# Altium schematic sheet lpc11c14.SchDoc
size A4; Organization: UNSW Solar Racing Team; Address3: UNSW; Address4: Sydney NSW 2052; Address2: Electrical Engineering; Address1: Rm 109
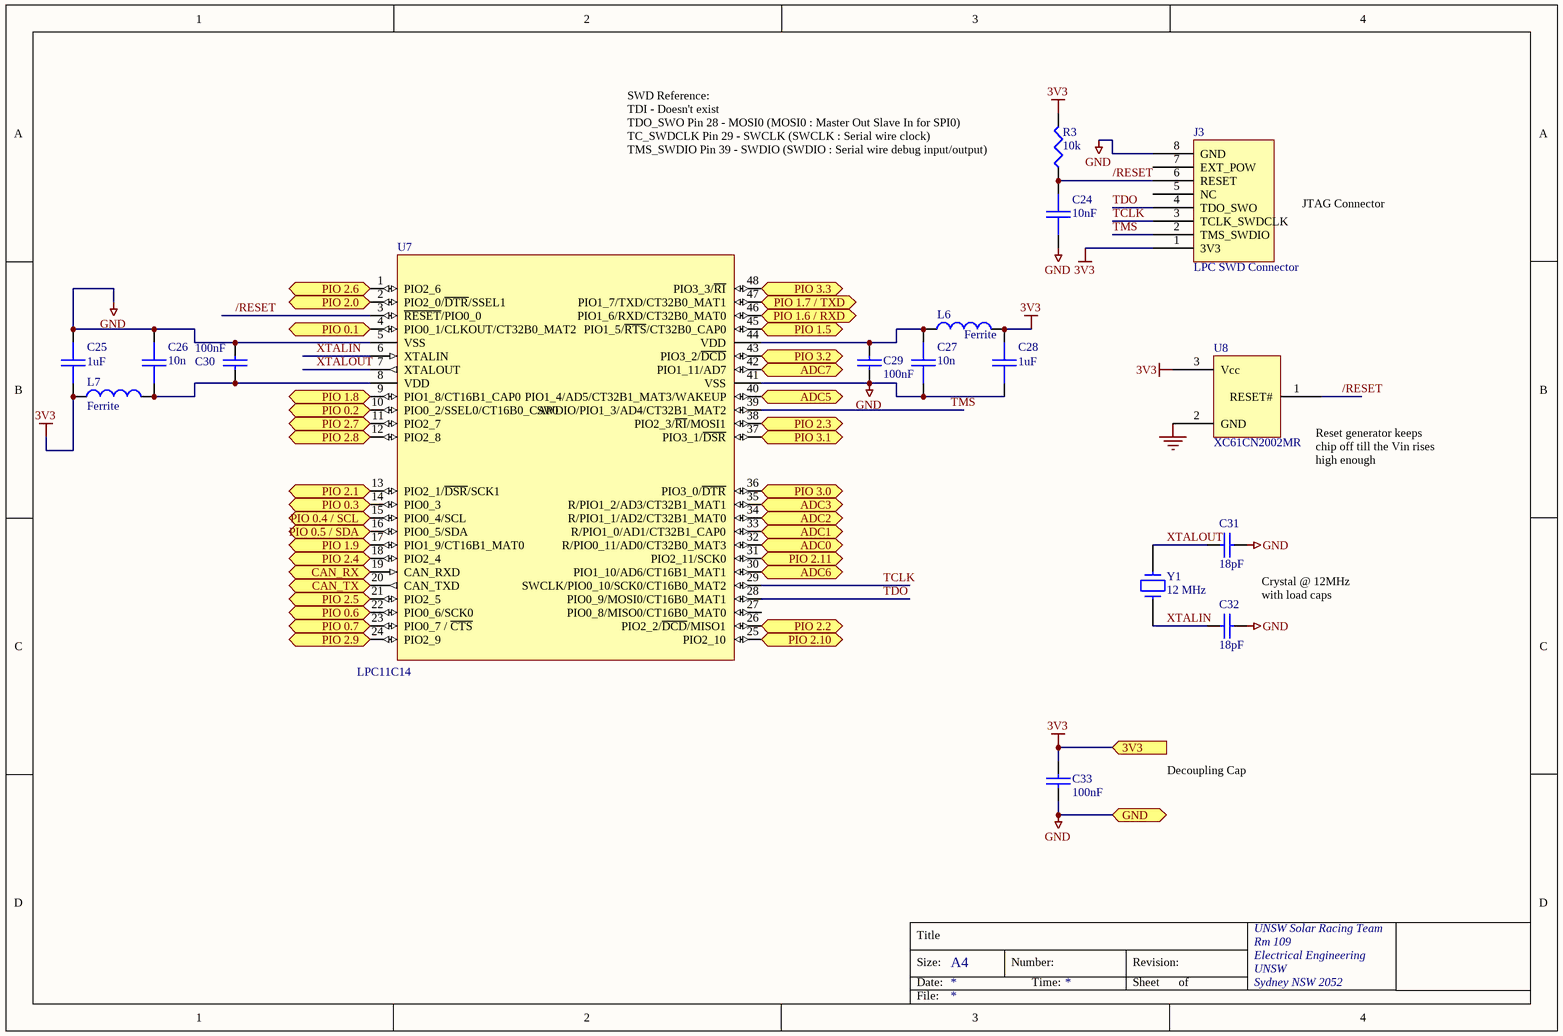
[diagram p0: lpc11c14.SchDoc]

## Parts
C24  10nF  [0603]
C25  value 1uF  [0603]  (hidden comment: 1u)
C26  10n  [0603]
C27  10n  [0603]
C28  value 1uF  [0603]  (hidden comment: 1u)
C29  100nF  [0603]
C30  100nF  [0603]
C31  18pF  [0603]
C32  18pF  [0603]
C33  100nF  [0603]
J3  LPC SWD Connector  [IDC8]
L6  Ferrite  [0603]
L7  Ferrite  [0603]
R3  10k  [0603]
U7  LPC11C14  [TSQFP50P900X900-48N]
U8  XC61CN2002MR  [SOT23(3)]
Y1  12 MHz  [HC49/4H]

## Ports
3V3, ADC0 (in), ADC1 (in), ADC2 (in), ADC3 (in), ADC5 (in), ADC6 (in), ADC7 (in), CAN_RX (in), CAN_TX (out), GND, PIO 0.1 (bidir), PIO 0.2 (bidir), PIO 0.3 (bidir), PIO 0.4 / SCL (bidir), PIO 0.5 / SDA (bidir), PIO 0.6 (bidir), PIO 0.7 (bidir), PIO 1.5 (bidir), PIO 1.6 / RXD (bidir), PIO 1.7 / TXD (bidir), PIO 1.8 (bidir), PIO 1.9 (bidir), PIO 2.0 (bidir), PIO 2.1 (bidir), PIO 2.2 (bidir), PIO 2.3 (bidir), PIO 2.4 (bidir), PIO 2.5 (bidir), PIO 2.6 (bidir), PIO 2.7 (bidir), PIO 2.8 (bidir), PIO 2.9 (bidir), PIO 2.10 (bidir), PIO 2.11 (bidir), PIO 3.0 (bidir), PIO 3.1 (bidir), PIO 3.2 (bidir), PIO 3.3 (bidir)

## Nets
3V3: C25.2 C28.1 C33.1 J3.1(3V3) L6.2 L7.1 R3.2 U8.3(Vcc) ; port 3V3
GND: C24.2 C25.1 C26.1 C27.2 C28.2 C29.2 C30.1 C31.2 C32.2 C33.2 J3.8(GND) U7.5(VSS) U7.41(VSS) U8.2(GND) ; port GND
/RESET: C24.1 J3.6(RESET) R3.1 U7.3(~{RESET}/PIO0_0) U8.1(RESET#)
ADC0: U7.32(R/PIO0_11/AD0/CT32B0_MAT3) ; port ADC0
ADC1: U7.33(R/PIO1_0/AD1/CT32B1_CAP0) ; port ADC1
ADC2: U7.34(R/PIO1_1/AD2/CT32B1_MAT0) ; port ADC2
ADC3: U7.35(R/PIO1_2/AD3/CT32B1_MAT1) ; port ADC3
ADC5: U7.40(PIO1_4/AD5/CT32B1_MAT3/WAKEUP) ; port ADC5
ADC6: U7.30(PIO1_10/AD6/CT16B1_MAT1) ; port ADC6
ADC7: U7.42(PIO1_11/AD7) ; port ADC7
CAN_RX: U7.19(CAN_RXD) ; port CAN_RX
CAN_TX: U7.20(CAN_TXD) ; port CAN_TX
PIO 0.1: U7.4(PIO0_1/CLKOUT/CT32B0_MAT2) ; port PIO 0.1
PIO 0.2: U7.10(PIO0_2/SSEL0/CT16B0_CAP0) ; port PIO 0.2
PIO 0.3: U7.14(PIO0_3) ; port PIO 0.3
PIO 0.4 / SCL: U7.15(PIO0_4/SCL) ; port PIO 0.4 / SCL
PIO 0.5 / SDA: U7.16(PIO0_5/SDA) ; port PIO 0.5 / SDA
PIO 0.6: U7.22(PIO0_6/SCK0) ; port PIO 0.6
PIO 0.7: U7.23(PIO0_7_/_~{CTS}) ; port PIO 0.7
PIO 1.5: U7.45(PIO1_5/~{RTS}/CT32B0_CAP0) ; port PIO 1.5
PIO 1.6 / RXD: U7.46(PIO1_6/RXD/CT32B0_MAT0) ; port PIO 1.6 / RXD
PIO 1.7 / TXD: U7.47(PIO1_7/TXD/CT32B0_MAT1) ; port PIO 1.7 / TXD
PIO 1.8: U7.9(PIO1_8/CT16B1_CAP0) ; port PIO 1.8
PIO 1.9: U7.17(PIO1_9/CT16B1_MAT0) ; port PIO 1.9
PIO 2.0: U7.2(PIO2_0/~{DTR}/SSEL1) ; port PIO 2.0
PIO 2.1: U7.13(PIO2_1/~{DSR}/SCK1) ; port PIO 2.1
PIO 2.2: U7.26(PIO2_2/~{DCD}/MISO1) ; port PIO 2.2
PIO 2.3: U7.38(PIO2_3/~{RI}/MOSI1) ; port PIO 2.3
PIO 2.4: U7.18(PIO2_4) ; port PIO 2.4
PIO 2.5: U7.21(PIO2_5) ; port PIO 2.5
PIO 2.6: U7.1(PIO2_6) ; port PIO 2.6
PIO 2.7: U7.11(PIO2_7) ; port PIO 2.7
PIO 2.8: U7.12(PIO2_8) ; port PIO 2.8
PIO 2.9: U7.24(PIO2_9) ; port PIO 2.9
PIO 2.10: U7.25(PIO2_10) ; port PIO 2.10
PIO 2.11: U7.31(PIO2_11/SCK0) ; port PIO 2.11
PIO 3.0: U7.36(PIO3_0/~{DTR}) ; port PIO 3.0
PIO 3.1: U7.37(PIO3_1/~{DSR}) ; port PIO 3.1
PIO 3.2: U7.43(PIO3_2/~{DCD}) ; port PIO 3.2
PIO 3.3: U7.48(PIO3_3/~{RI}) ; port PIO 3.3
TCLK: J3.3(TCLK_SWDCLK) U7.29(SWCLK/PIO0_10/SCK0/CT16B0_MAT2)
TDO: J3.4(TDO_SWO) U7.28(PIO0_9/MOSI0/CT16B0_MAT1)
TMS: J3.2(TMS_SWDIO) U7.39(SWDIO/PIO1_3/AD4/CT32B1_MAT2)
XTALIN: C32.1 U7.6(XTALIN) Y1.1
XTALOUT: C31.1 U7.7(XTALOUT) Y1.2
NetC26_2: C26.2 C30.2 L7.2 U7.8(VDD)
NetC27_1: C27.1 C29.1 L6.1 U7.44(VDD)

Not connected (* = marked no-connect by the designer): J3 5(NC) 7(EXT_POW); U7 27(PIO0_8/MISO0/CT16B0_MAT0)

## Notes on the sheet
- SWD Reference:
  TDI - Doesn't exist
  TDO_SWO Pin 28 - MOSI0 (MOSI0 : Master Out Slave In for SPI0)
  TC_SWDCLK Pin 29 - SWCLK (SWCLK : Serial wire clock)
  TMS_SWDIO Pin 39 - SWDIO (SWDIO : Serial wire debug input/output)
- JTAG Connector
- (near U8) Reset generator keeps chip off till the Vin rises high enough
- Crystal @ 12MHz with load caps
- Decoupling Cap
- Title
- Size:
- Date:
- A4
- Number:
- Time:
- Revision:
- Sheet
- of
- File:

## Library data of the parts
C24 C29 C30 C33 = CAP: Capacitor; Needed?: NO - HW LAB
  C24: Value: 10nF
  C29 C30 C33: Value: 100nF
C25 C28 = CAP: Capacitor; Needed?: RS; RS: 640-6404; RS Price: 0.06
C26 C27 = CAP: Capacitor; Value: 1nF; Needed?: NO - HW LAB; Revision: July-2002: Re-released for DXP Platform.
C31 C32 = CAP: Capacitor; Needed?: Farnell; Value: 18pF; Farnell: 1844169; Farnell Price: 0.025
J3 = LPCLink_Connector: Needed?: NO - Common
L6 L7 = INDUCTOR: Manufacturer: Generic Components; Needed?: Farnell; Published: 8-Jun-2000; Revision: July-2002: Re-released for DXP Platform.; Publisher: Altium Limited; Farnell: 1839565; Farnell Price: 0.65
R3 = RES1: Resistor; Needed?: NO - HW LAB; Value: 10k
U7 = LPC11C14_Full: Needed?: Farnell; Farnell: 1812185; Farnell Price: 8.38
U8 = XC61F: SOT23 reset generator; Needed?: Farnell; Farnell: 3605486; Farnell Price: 1.74
Y1 = CRYSTAL: Needed?: RS; RS: 693-8803; RS Price: 0.95